# Altium schematic sheet input.SchDoc: supply
size A4; SheetNumber: 1; SheetTotal: 1
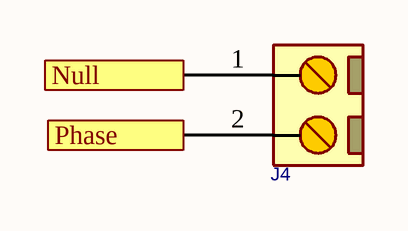
[diagram p0: input.SchDoc]

## Parts
J4  CONN_GMSTB2  [GMSTB762_2]  (value not drawn)

## Ports
Null, Phase

## Nets
Null: J4.1 ; port Null
Phase: J4.2 ; port Phase

## Notes on the sheet
- Title:
- Project:
- Drawn by:
- Revision:
- Hossein Bagheri
- Company:
- Sheet
- of

## Library data of the parts
J4 = CONN_GMSTB762_2: CONN, PHOENIX GMSTB, 7.62mm pitch; MANF_P#: GMSTB 2,5/2-G-7,62; VALUE: CONN_GMSTB2